# EAGLE schematic BATT_INPUT (EAGLE 9.6.2)
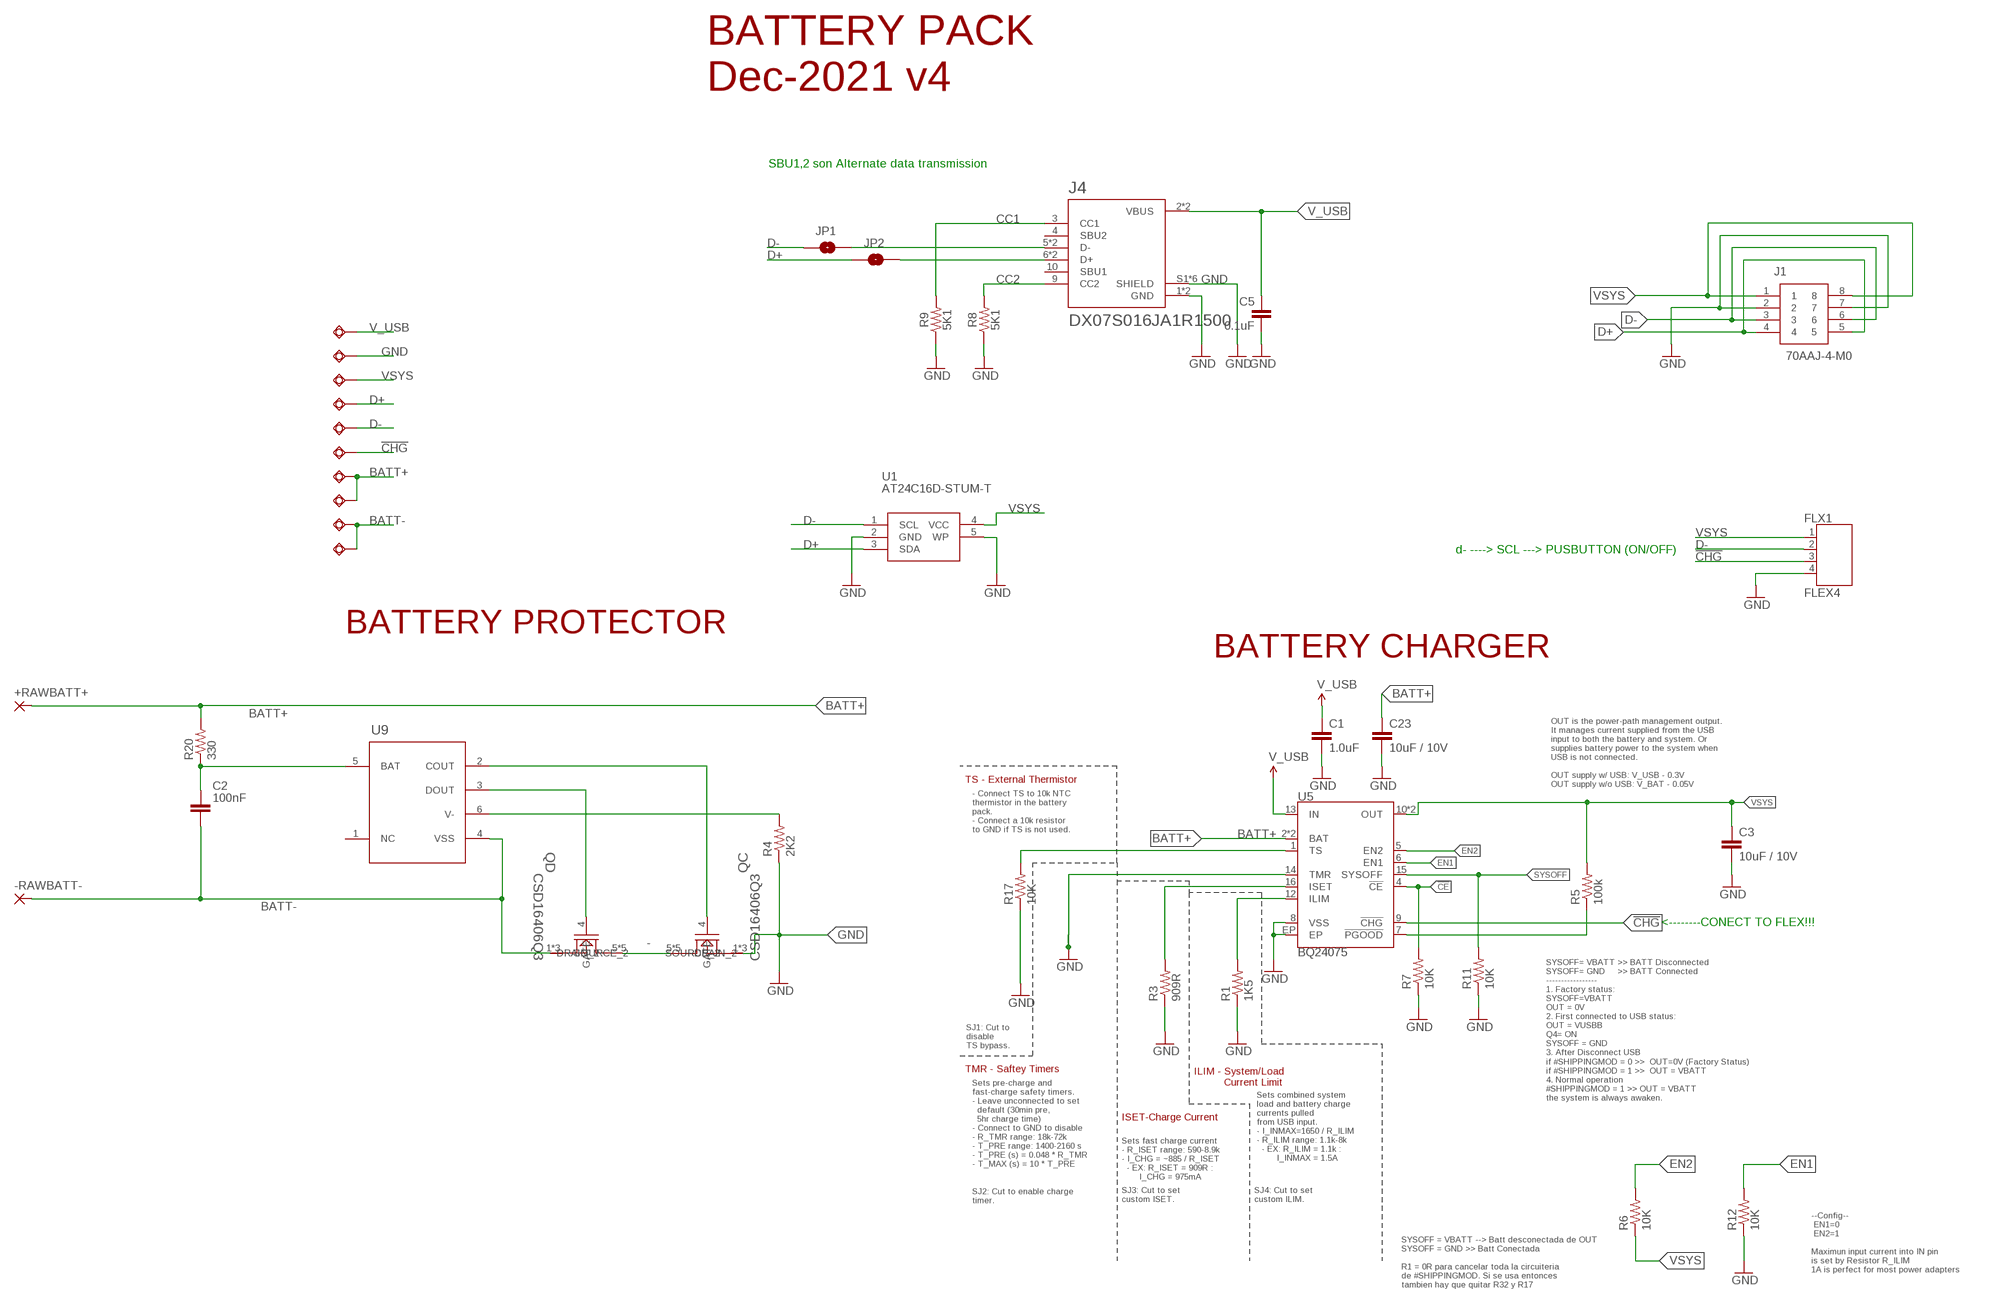
[diagram p0: schematic, sheet 1]

## Parts
!CHG!  TESTPAD_TPSQB1,27  [TESTPAD_B1,27]
+RAWBATT+  SMD5  [SMD2,54-5,08]
-RAWBATT-  SMD5  [SMD2,54-5,08]
BATT+1  TESTPAD_TPSQB1,27  [TESTPAD_B1,27]
BATT+2  TESTPAD_TPSQB1,27  [TESTPAD_B1,27]
BATT-1  TESTPAD_TPSQB1,27  [TESTPAD_B1,27]
BATT-2  TESTPAD_TPSQB1,27  [TESTPAD_B1,27]
C1  1.0uF  1.0UF-0603-16V-10%  [0603]
C2  100nF  C_CHIP-0603(1608-METRIC)  [CAPC1608X85]
C3  10uF / 10V  10UF10V10%(0805)  [0805-CAP]
C5  0.1uF  0.1UF-0603-25V-(+80/-20%)  [0603]
C23  10uF / 10V  10UF10V10%(0805)  [0805-CAP]
D+  TESTPAD_TPSQB1,27  [TESTPAD_B1,27]
D-  TESTPAD_TPSQB1,27  [TESTPAD_B1,27]
FLX1  FLEX4  [FLEX4]
GND  TESTPAD_TPSQB1,27  [TESTPAD_B1,27]
J1  70AAJ-4-M0  [70AAJ4M0]
J4  DX07S016JA1R1500  [JAE_DX07S016JA1R1500]
JP1  JUMPER-SMT_2_NO_SILK  [SMT-JUMPER_2_NO_SILK]
JP2  JUMPER-SMT_2_NO_SILK  [SMT-JUMPER_2_NO_SILK]
QC  CSD16406Q3  [DQG0008A]
QD  CSD16406Q3  [DQG0008A]
R1  1K5  RESISTOR0402  [0402]
R3  909R  RESISTOR0402  [0402]
R4  2K2  RESISTOR0402  [0402]
R5  100k  RESISTOR0402  [0402]
R6  10K  RESISTOR0402  [0402]
R7  10K  RESISTOR0402  [0402]
R8  5K1  RESISTOR0402  [0402]
R9  5K1  RESISTOR0402  [0402]
R11  10K  RESISTOR0402  [0402]
R12  10K  RESISTOR0402  [0402]
R17  10K  RESISTOR0402  [0402]
R20  330  RESISTOR0402  [0402]
U1  AT24C16D-STUM-T  [SOT95P280X100-5N]
U5  BQ24075  [PVQFN-N16]
U9  BQ29700DSER  [DSE0006A]
V_USB  TESTPAD_TPSQB1,27  [TESTPAD_B1,27]
VSYS  TESTPAD_TPSQB1,27  [TESTPAD_B1,27]

## Nets
!CE!: R7.2 U5.4(!CE!)
!CHG!: !CHG!.TP FLX1.3 U5.9(!CHG!)
-: QC.5(DRAIN_2) QC.6(DRAIN_2) QC.7(DRAIN_2) QC.8(DRAIN_2) QC.9(DRAIN_2) QD.5(DRAIN_2) QD.6(DRAIN_2) QD.7(DRAIN_2) QD.8(DRAIN_2) QD.9(DRAIN_2)
BATT+: +RAWBATT+.1(P) BATT+1.TP BATT+2.TP C23.1 R20.2 U5.2(BAT) U5.3(BAT)
BATT-: -RAWBATT-.1(P) BATT-1.TP BATT-2.TP C2.2 QD.1(SOURCE_2) QD.2(SOURCE_2) QD.3(SOURCE_2) U9.4(VSS)
CC1: J4.3(CC1) R9.2
CC2: J4.9(CC2) R8.2
D+: D+.TP J1.4 J1.5 JP2.1 U1.3(SDA)
D-: D-.TP FLX1.2 J1.3 J1.6 JP1.1 U1.1(SCL)
EN1: R12.2 U5.6(EN1)
EN2: R6.2 U5.5(EN2)
GND: C1.2 C3.2 C5.2 C23.2 FLX1.4 GND.TP J1.2 J1.7 J4.1(GND) J4.12(GND) J4.S1(SHIELD) J4.S2(SHIELD) J4.S3(SHIELD) J4.S4(SHIELD) J4.S5(SHIELD) J4.S6(SHIELD) QC.1(SOURCE_2) QC.2(SOURCE_2) QC.3(SOURCE_2) R1.1 R3.1 R4.1 R7.1 R8.1 R9.1 R11.1 R12.1 R17.1 U1.2(GND) U1.5(WP) U5.8(VSS) U5.14(TMR) U5.EP
ILIM: R1.2 U5.12(ILIM)
ISET: R3.2 U5.16(ISET)
N$1: R5.1 U5.7(!PGOOD!)
N$2: J4.5(D-) J4.8(D-) JP1.2
N$3: J4.6(D+) J4.7(D+) JP2.2
N$12: C2.1 R20.1 U9.5(BAT)
N$20: R4.2 U9.6(V-)
N$25: QC.4(GATE) U9.2(COUT)
N$26: QD.4(GATE) U9.3(DOUT)
SYSOFF: R11.2 U5.15(SYSOFF)
TS1: R17.2 U5.1(TS)
V_USB: C1.1 C5.1 J4.2(VBUS) J4.11(VBUS) U5.13(IN) V_USB.TP
VSYS: C3.1 FLX1.1 J1.1 J1.8 R5.2 R6.1 U1.4(VCC) U5.10(OUT) U5.11(OUT) VSYS.TP
Unconnected: J4.4(SBU2) J4.10(SBU1) U9.1(NC)

## Notes on the sheet
- BATTERY PACK
  Dec-2021 v4
- SBU1,2 son Alternate data transmission
- d- ----> SCL ---> PUSBUTTON (ON/OFF)
- BATTERY PROTECTOR
- BATTERY CHARGER
- OUT is the power-path management output.
  It manages current supplied from the USB 
  input to both the battery and system. Or
  supplies battery power to the system when 
  USB is not connected.
  
  OUT supply w/ USB: V_USB - 0.3V
  OUT supply w/o USB: V_BAT - 0.05V
- TS - External Thermistor
- - Connect TS to 10k NTC 
  thermistor in the battery
  pack.
  - Connect a 10k resistor 
  to GND if TS is not used.
- <--------CONECT TO FLEX!!!
- SYSOFF= VBATT >> BATT Disconnected
  SYSOFF= GND     >> BATT Connected
  -----------------
  1. Factory status:
  SYSOFF=VBATT
  OUT = 0V
  2. First connected to USB status:
  OUT = VUSBB
  Q4= ON
  SYSOFF = GND
  3. After Disconnect USB
  if #SHIPPINGMOD = 0 >>  OUT=0V (Factory Status)
  if #SHIPPINGMOD = 1 >>  OUT = VBATT
  4. Normal operation
  #SHIPPINGMOD = 1 >> OUT = VBATT 
  the system is always awaken.
- SJ1: Cut to 
  disable
  TS bypass.
- TMR - Saftey Timers
- ILIM - System/Load 
            Current Limit
- Sets pre-charge and
  fast-charge safety timers.
  - Leave unconnected to set
    default (30min pre, 
    5hr charge time)
  - Connect to GND to disable
  - R_TMR range: 18k-72k
  - T_PRE range: 1400-2160 s
  - T_PRE (s) = 0.048 * R_TMR
  - T_MAX (s) = 10 * T_PRE
- Sets combined system
  load and battery charge 
  currents pulled
  from USB input.
  - I_INMAX=1650 / R_ILIM
  - R_ILIM range: 1.1k-8k
    - EX: R_ILIM = 1.1k : 
          I_INMAX = 1.5A
- ISET-Charge Current
- Sets fast charge current
  - R_ISET range: 590-8.9k
  - I_CHG = ~885 / R_ISET
    - EX: R_ISET = 909R : 
         I_CHG = 975mA
- SJ3: Cut to set
  custom ISET.
- SJ4: Cut to set
  custom ILIM.
- SJ2: Cut to enable charge
  timer.
- --Config--
   EN1=0 
   EN2=1
  
  Maximun input current into IN pin
  is set by Resistor R_ILIM
  1A is perfect for most power adapters
- SYSOFF = VBATT --> Batt desconectada de OUT
  SYSOFF = GND >> Batt Conectada
  
  R1 = 0R para cancelar toda la circuiteria
  de #SHIPPINGMOD. Si se usa entonces
  tambien hay que quitar R32 y R17

## Library data of the parts
!CHG! BATT+1 BATT+2 BATT-1 BATT-2 D+ D- GND V_USB VSYS = BeagleBone_Blue_R3:TESTPAD_TPSQ: Test pad
+RAWBATT+ -RAWBATT- = wirepad:SMD5: SMD PAD
C1 = SparkFun-Capacitors:1.0UF: 1µF ceramic capacitors A capacitor is a passive two-terminal electrical component used to store electrical energy temporarily in an electric field.; PROD_ID: CAP-00868
C2 = Tutorial - Fusion 360:C: Capacitor - Generic; CATEGORY: Capacitor
C3 C23 = SparkFun-Capacitors:10UF10V10%(0805): CAP-11330; PROD_ID: CAP-11330
C5 = SparkFun-Capacitors:0.1UF: 0.1µF ceramic capacitors A capacitor is a passive two-terminal electrical component used to store electrical energy temporarily in an electric field.; PROD_ID: CAP-00810
FLX1 = Flex4:FLEX4
J1 = ANTENNA:70AAJ-4-M0: Bourns Male 4 Way Modular Contact, Surface Mount, 3A, 60 V Source: Datasheet <https://componentsearchengine.com/Datasheets/1/70AAJ-4-M0.pdf>; DESCRIPTION: Bourns Male 4 Way Modular Contact, Surface Mount, 3A, 60 V; HEIGHT: 3.81mm; MANUFACTURER_NAME: Bourns; MANUFACTURER_PART_NUMBER: 70AAJ-4-M0; MOUSER_PART_NUMBER: 652-70AAJ-4-M0; MOUSER_PRICE-STOCK: https://www.mouser.com/Search/Refine.aspx?Keyword=652-70AAJ-4-M0
J4 = DX07S016JA1R1500:DX07S016JA1R1500: USB-C (USB TYPE-C) USB 2.0 Receptacle Connector 24 (16+8 Dummy) Position Surface Mount, Right Angle; Through Hole; DESCRIPTION: USB-C (USB TYPE-C) USB 2.0 Receptacle Connector 24 (16+8 Dummy) Position Surface Mount, Right Angle; Through Hole; DIGI-KEY_PART_NUMBER: 670-DX07S016JA1R1500CT-ND; MF: JAE Electronics; MP: DX07S016JA1R1500; PACKAGE: None; PURCHASE-URL: https://pricing.snapeda.com/search/part/DX07S016JA1R1500/?ref=eda
JP1 JP2 = SparkFun-Jumpers:JUMPER-SMT_2_NO: Normally open jumper This jumper has two pads in close proximity to each other. Apply solder to close the connection. Round pads are easier to solder for beginners, but are a lot larger. SparkFun Product that uses the round pads: SparkFun EL Sequencer <https://www.sparkfun.com/products/12781>
QC QD = CSD16406Q3:CSD16406Q3; DATASHEET_URL: http://www.ti.com/lit/ds/symlink/csd16406q3.pdf; IDSMAX: 60.0; MANUFACTURER_PART_NUMBER: CSD16406Q3; QGTYP: 5.8; QUANTITY: 1; RDSON45: 0.0059; VDSMAX: 25.0; VENDOR: Texas Instruments
R1 R3-R9 R11 R12 R17 R20 = SparkFun-Resistors:RESISTOR: Generic Resistor Package
U1 = AT24C16D-STUM-T:AT24C16D-STUM-T: EEPROM Serial-2Wire 16K-bit 2K x 8 1.8V/2.5V/3.3V 5-Pin SOT-23 T/R Source: Datasheet <https://www.arrow.com/en/products/at24c16d-stum-t/microchip-technology>; ARROW_PART_NUMBER: AT24C16D-STUM-T; ARROW_PRICE-STOCK: https://www.arrow.com/en/products/at24c16d-stum-t/microchip-technology; DESCRIPTION: EEPROM Serial-2Wire 16K-bit 2K x 8 1.8V/2.5V/3.3V 5-Pin SOT-23 T/R; HEIGHT: 1mm; MANUFACTURER_NAME: Microchip; MANUFACTURER_PART_NUMBER: AT24C16D-STUM-T; MOUSER_PART_NUMBER: 556-AT24C16D-STUM-T; MOUSER_PRICE-STOCK: https://www.mouser.co.uk/ProductDetail/Microchip-Technology-Atmel/AT24C16D-STUM-T?qs=YAvGbpKWXiSFXLERVL65hQ%3D%3D
U5 = battery-management-temp:BQ24075; PROD_ID: IC-13219
U9 = BQ2970:BQ29700DSER; MANUFACTURER: Texas Instruments; PARTNUMBER: BQ29705DSER; REFDES: RefDes; TYPE: TYPE; VALUE: Value

## Net classes
1 power: width 0.178 mm
2 gnd: width 0.305 mm, drill 0.483 mm, clearance 0.203 mm